# Altium project Sampler.PrjPCB (part 5 of 5)
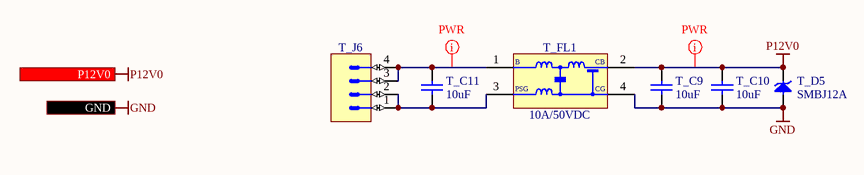
[diagram p15: PWR_input_connector.SchDoc]

## Nets that join several sheets
GND: Power_Supplies (24 pins), Power-up_delay (9 pins), Power_main_DCDC (91 pins), CPCIS_Connectors_P1_P6 (55 pins), DIOT_signal_routing (T_C22.1 T_C23.1 T_IC8.4), EEM_Connectors (34 pins), Temperature_monitoring (5 pins), Mechanical (21 pins), FP_Connectors (20 pins), ADC_8CH (30 pins), U_Input_channel0 (17 pins), U_Input_channel1 (17 pins), U_Input_channel2 (17 pins), U_Input_channel3 (17 pins), U_Input_channel4 (17 pins), U_Input_channel5 (17 pins), U_Input_channel6 (17 pins), U_Input_channel7 (17 pins), Drivers (40 pins), I2C_switch (T_C24.1 T_C25.1 T_IC9.4 T_R6.1), PWR_input_connector (T_C9.1 T_C10.1 T_D5.2 T_FL1.4)
N12V0A: Power_Supplies (LD12.1 TP9.1), Power_main_DCDC (8 pins), ADC_8CH (C105.2 IC35.4), U_Input_channel0 (8 pins), U_Input_channel1 (8 pins), U_Input_channel2 (8 pins), U_Input_channel3 (8 pins), U_Input_channel4 (8 pins), U_Input_channel5 (8 pins), U_Input_channel6 (8 pins), U_Input_channel7 (8 pins)
N13V0: Power_Supplies (LD13.1 TP20.1), Power_main_DCDC (8 pins), FP_Connectors (R42.2)
P2V5A: Power_Supplies (R91.1 TP10.1), Power_main_DCDC (7 pins), ADC_8CH (7 pins), Drivers (C16.2 IC7.1)
P3V3: Power_Supplies (R87.2 TP17.1), Power_main_DCDC (10 pins), FP_Connectors (16 pins), Drivers (41 pins), I2C_switch (T_C25.2 T_IC9.1 T_R67.2 T_R68.2)
P3V3_MP: Power_Supplies (5 pins), Power-up_delay (6 pins), DIOT_signal_routing (T_C22.2 T_C23.2 T_IC8.1 T_IC8.8), EEM_Connectors (5 pins), Temperature_monitoring (T_C8.2 T_IC6.8), I2C_switch (T_C24.2 T_IC9.8)
P3V3_MP2: Power_Supplies (R90.2 TP19.1), EEM_Connectors (5 pins)
P3V3A: Power_Supplies (R88.2 TP11.1), Power_main_DCDC (8 pins)
P5V0A: Power_Supplies (R85.2 TP13.1), Power_main_DCDC (5 pins), ADC_8CH (10 pins)
P6V0A: Power_Supplies (R84.2 TP12.1), Power_main_DCDC (8 pins)
P12V0: Power_Supplies (6 pins), Power-up_delay (T_R29.2), Power_main_DCDC (C29.2 C57.2 IC27.8 L4.1), CPCIS_Connectors_P1_P6 (7 pins), EEM_Connectors (T_J1.28 T_J1.29 T_J2.28 T_J2.29), FP_Connectors (R86.2), PWR_input_connector (T_C9.2 T_C10.2 T_D5.1 T_FL1.2)
P12V0A: Power_Supplies (R48.2 TP7.1), Power_main_DCDC (6 pins), ADC_8CH (C104.2 IC35.8), U_Input_channel0 (7 pins), U_Input_channel1 (7 pins), U_Input_channel2 (7 pins), U_Input_channel3 (7 pins), U_Input_channel4 (7 pins), U_Input_channel5 (7 pins), U_Input_channel6 (7 pins), U_Input_channel7 (7 pins)
P13V0: Power_Supplies (R46.2 TP1.1), Power_main_DCDC (9 pins), FP_Connectors (R41.2)
REF_P1V7066: ADC_8CH (IC35.1 R83.2 RN3.3), U_Input_channel0 (R7H.1 RN2H.5 RN2H.8), U_Input_channel1 (R7A.1 RN2A.5 RN2A.8), U_Input_channel2 (R7B.1 RN2B.5 RN2B.8), U_Input_channel3 (R7C.1 RN2C.5 RN2C.8), U_Input_channel4 (R7D.1 RN2D.5 RN2D.8), U_Input_channel5 (R7E.1 RN2E.5 RN2E.8), U_Input_channel6 (R7F.1 RN2F.5 RN2F.8), U_Input_channel7 (R7G.1 RN2G.5 RN2G.8)
REF_P2V048: ADC_8CH (IC35.7 RN3.2 RN4.6), U_Input_channel0 (R13H.1), U_Input_channel1 (R13A.1), U_Input_channel2 (R13B.1), U_Input_channel3 (R13C.1), U_Input_channel4 (R13D.1), U_Input_channel5 (R13E.1), U_Input_channel6 (R13F.1), U_Input_channel7 (R13G.1)
REF_P4V096: Power_Supplies (TP15.1), Power_main_DCDC (5 pins), ADC_8CH (R81.1 RN3.4)
REF_VCC: Power_Supplies (R49.2 TP8.1), Power_main_DCDC (8 pins)
A00: U_Input_channel0 (IC2H.4), Drivers (IC19.15)
A01: U_Input_channel1 (IC2A.4), Drivers (IC19.2)
A02: U_Input_channel2 (IC2B.4), Drivers (IC19.4)
A03: U_Input_channel3 (IC2C.4), Drivers (IC19.6)
A04: U_Input_channel4 (IC2D.4), Drivers (IC20.15)
A05: U_Input_channel5 (IC2E.4), Drivers (IC20.2)
A06: U_Input_channel6 (IC2F.4), Drivers (IC20.4)
A07: U_Input_channel7 (IC2G.4), Drivers (IC20.6)
A10: U_Input_channel0 (IC2H.5), Drivers (IC19.1)
A11: U_Input_channel1 (IC2A.5), Drivers (IC19.3)
A12: U_Input_channel2 (IC2B.5), Drivers (IC19.5)
A13: U_Input_channel3 (IC2C.5), Drivers (IC19.7)
A14: U_Input_channel4 (IC2D.5), Drivers (IC20.1)
A15: U_Input_channel5 (IC2E.5), Drivers (IC20.3)
A16: U_Input_channel6 (IC2F.5), Drivers (IC20.5)
A17: U_Input_channel7 (IC2G.5), Drivers (IC20.7)
ADC_CLKOUT_N: ADC_8CH (IC36.34), Drivers (IC13.8 R20.2)
ADC_CLKOUT_P: ADC_8CH (IC36.33), Drivers (IC13.1 R20.1)
ADC_CNV: ADC_8CH (IC36.24), Drivers (IC7.5)
ADC_IN_N0: ADC_8CH (IC36.47), U_Input_channel0 (C4H.2 C6H.2 R6H.2)
ADC_IN_N1: ADC_8CH (IC36.50), U_Input_channel1 (C4A.2 C6A.2 R6A.2)
ADC_IN_N2: ADC_8CH (IC36.1), U_Input_channel2 (C4B.2 C6B.2 R6B.2)
ADC_IN_N3: ADC_8CH (IC36.4), U_Input_channel3 (C4C.2 C6C.2 R6C.2)
ADC_IN_N4: ADC_8CH (IC36.10), U_Input_channel4 (C4D.2 C6D.2 R6D.2)
ADC_IN_N5: ADC_8CH (IC36.13), U_Input_channel5 (C4E.2 C6E.2 R6E.2)
ADC_IN_N6: ADC_8CH (IC36.16), U_Input_channel6 (C4F.2 C6F.2 R6F.2)
ADC_IN_N7: ADC_8CH (IC36.19), U_Input_channel7 (C4G.2 C6G.2 R6G.2)
ADC_IN_P0: ADC_8CH (IC36.48), U_Input_channel0 (C6H.1 C7H.1 R12H.2)
ADC_IN_P1: ADC_8CH (IC36.51), U_Input_channel1 (C6A.1 C7A.1 R12A.2)
ADC_IN_P2: ADC_8CH (IC36.2), U_Input_channel2 (C6B.1 C7B.1 R12B.2)
ADC_IN_P3: ADC_8CH (IC36.5), U_Input_channel3 (C6C.1 C7C.1 R12C.2)
ADC_IN_P4: ADC_8CH (IC36.11), U_Input_channel4 (C6D.1 C7D.1 R12D.2)
ADC_IN_P5: ADC_8CH (IC36.14), U_Input_channel5 (C6E.1 C7E.1 R12E.2)
ADC_IN_P6: ADC_8CH (IC36.17), U_Input_channel6 (C6F.1 C7F.1 R12F.2)
ADC_IN_P7: ADC_8CH (IC36.20), U_Input_channel7 (C6G.1 C7G.1 R12G.2)
ADC_SCK_N: ADC_8CH (IC36.42 R79.1), Drivers (IC4.5)
ADC_SCK_P: ADC_8CH (IC36.41 R79.2), Drivers (IC4.6)
ADC_SDOA_N: ADC_8CH (IC36.28), Drivers (IC5.1 IC14.1 R21.1)
ADC_SDOA_P: ADC_8CH (IC36.27), Drivers (IC5.8 IC14.8 R21.2)
ADC_SDOB_N: ADC_8CH (IC36.30), Drivers (IC15.8 R22.2)
ADC_SDOB_P: ADC_8CH (IC36.29), Drivers (IC15.1 R22.1)
ADC_SDOC_N: ADC_8CH (IC36.36), Drivers (IC16.8 R23.2)
ADC_SDOC_P: ADC_8CH (IC36.35), Drivers (IC16.1 R23.1)
ADC_SDOD_N: ADC_8CH (IC36.40), Drivers (IC17.8 R24.2)
ADC_SDOD_P: ADC_8CH (IC36.39), Drivers (IC17.1 R24.1)
BP_I2C.SCL: CPCIS_Connectors_P1_P6 (T_D2.3 T_J4.B2), DIOT_signal_routing (T_IC8.6)
BP_I2C.SDA: CPCIS_Connectors_P1_P6 (T_D2.1 T_J4.C2), DIOT_signal_routing (T_IC8.7)
BP_IO.LVDS_N0: CPCIS_Connectors_P1_P6 (T_J4.E3), DIOT_signal_routing (T_R51.1)
BP_IO.LVDS_N1: CPCIS_Connectors_P1_P6 (T_J4.B3), DIOT_signal_routing (T_R52.1)
BP_IO.LVDS_N2: CPCIS_Connectors_P1_P6 (T_J4.C4), DIOT_signal_routing (T_R53.1)
BP_IO.LVDS_N3: CPCIS_Connectors_P1_P6 (T_J4.L4), DIOT_signal_routing (T_R54.1)
BP_IO.LVDS_N4: CPCIS_Connectors_P1_P6 (T_J4.I4), DIOT_signal_routing (T_R55.1)
BP_IO.LVDS_N5: CPCIS_Connectors_P1_P6 (T_J4.K5), DIOT_signal_routing (T_R56.1)
BP_IO.LVDS_N6: CPCIS_Connectors_P1_P6 (T_J4.H5), DIOT_signal_routing (T_R57.1)
BP_IO.LVDS_N7: CPCIS_Connectors_P1_P6 (T_J4.F6), DIOT_signal_routing (T_R58.1)
BP_IO.LVDS_N8: CPCIS_Connectors_P1_P6 (T_J4.C6), DIOT_signal_routing (T_R59.1)
BP_IO.LVDS_N9: CPCIS_Connectors_P1_P6 (T_J4.L6), DIOT_signal_routing (T_R60.1)
BP_IO.LVDS_N10: CPCIS_Connectors_P1_P6 (T_J4.I6), DIOT_signal_routing (T_R61.1)
BP_IO.LVDS_N11: CPCIS_Connectors_P1_P6 (T_J5.E1), DIOT_signal_routing (T_R62.1)
BP_IO.LVDS_N12: CPCIS_Connectors_P1_P6 (T_J5.B1), DIOT_signal_routing (T_R63.1)
BP_IO.LVDS_P0: CPCIS_Connectors_P1_P6 (T_J4.D3), DIOT_signal_routing (T_R35.1)
BP_IO.LVDS_P1: CPCIS_Connectors_P1_P6 (T_J4.A3), DIOT_signal_routing (T_R36.1)
BP_IO.LVDS_P2: CPCIS_Connectors_P1_P6 (T_J4.B4), DIOT_signal_routing (T_R37.1)
BP_IO.LVDS_P3: CPCIS_Connectors_P1_P6 (T_J4.K4), DIOT_signal_routing (T_R38.1)
BP_IO.LVDS_P4: CPCIS_Connectors_P1_P6 (T_J4.H4), DIOT_signal_routing (T_R39.1)
BP_IO.LVDS_P5: CPCIS_Connectors_P1_P6 (T_J4.J5), DIOT_signal_routing (T_R40.1)
BP_IO.LVDS_P6: CPCIS_Connectors_P1_P6 (T_J4.G5), DIOT_signal_routing (T_R41.1)
BP_IO.LVDS_P7: CPCIS_Connectors_P1_P6 (T_J4.E6), DIOT_signal_routing (T_R42.1)
BP_IO.LVDS_P8: CPCIS_Connectors_P1_P6 (T_J4.B6), DIOT_signal_routing (T_R43.1)
BP_IO.LVDS_P9: CPCIS_Connectors_P1_P6 (T_J4.K6), DIOT_signal_routing (T_R44.1)
BP_IO.LVDS_P10: CPCIS_Connectors_P1_P6 (T_J4.H6), DIOT_signal_routing (T_R45.1)
BP_IO.LVDS_P11: CPCIS_Connectors_P1_P6 (T_J5.D1), DIOT_signal_routing (T_R46.1)
BP_IO.LVDS_P12: CPCIS_Connectors_P1_P6 (T_J5.A1), DIOT_signal_routing (T_R47.1)
EEM0_I2C.SCL: DIOT_signal_routing (T_IC8.3), EEM_Connectors (T_D1.3 T_IC2.1 T_IC3.6 T_J1.27), Temperature_monitoring (T_IC6.2), I2C_switch (T_IC9.6)
EEM0_I2C.SDA: DIOT_signal_routing (T_IC8.2), EEM_Connectors (T_D1.1 T_IC2.3 T_IC3.5 T_J1.26), Temperature_monitoring (T_IC6.1), I2C_switch (T_IC9.7)
EEM0_INT_I2C.SCL: Drivers (IC3.14), I2C_switch (T_IC9.3 T_R68.1)
EEM0_INT_I2C.SDA: Drivers (IC3.15), I2C_switch (T_IC9.2 T_R67.1)
EEM_IO.LVDS_N0: DIOT_signal_routing (T_R51.2), EEM_Connectors (T_J1.3), Drivers (IC4.1 R14.1)
EEM_IO.LVDS_N1: DIOT_signal_routing (T_R52.2), EEM_Connectors (T_J1.6), Drivers (IC5.5)
EEM_IO.LVDS_N2: DIOT_signal_routing (T_R53.2), EEM_Connectors (T_J1.9), Drivers (IC6.4 R15.1)
EEM_IO.LVDS_N3: DIOT_signal_routing (T_R54.2), EEM_Connectors (T_J1.12), Drivers (IC7.4 R16.1)
EEM_IO.LVDS_N4: DIOT_signal_routing (T_R55.2), EEM_Connectors (T_J1.15), Drivers (IC8.4 R17.1)
EEM_IO.LVDS_N5: DIOT_signal_routing (T_R56.2), EEM_Connectors (T_J1.18), Drivers (IC9.4 R18.1)
EEM_IO.LVDS_N6: DIOT_signal_routing (T_R57.2), EEM_Connectors (T_J1.21), Drivers (IC10.3)
EEM_IO.LVDS_N7: DIOT_signal_routing (T_R58.2), EEM_Connectors (T_J1.24), Drivers (IC11.4 R19.1)
EEM_IO.LVDS_N8: DIOT_signal_routing (T_R59.2), EEM_Connectors (T_J2.3), Drivers (IC13.5)
EEM_IO.LVDS_N9: DIOT_signal_routing (T_R60.2), EEM_Connectors (T_J2.6), Drivers (IC14.5)
EEM_IO.LVDS_N10: DIOT_signal_routing (T_R61.2), EEM_Connectors (T_J2.9), Drivers (IC15.5)
EEM_IO.LVDS_N11: DIOT_signal_routing (T_R62.2), EEM_Connectors (T_J2.12), Drivers (IC16.5)
EEM_IO.LVDS_N12: DIOT_signal_routing (T_R63.2), EEM_Connectors (T_J2.15), Drivers (IC17.5)
EEM_IO.LVDS_P0: DIOT_signal_routing (T_R35.2), EEM_Connectors (T_J1.2), Drivers (IC4.8 R14.2)
EEM_IO.LVDS_P1: DIOT_signal_routing (T_R36.2), EEM_Connectors (T_J1.5), Drivers (IC5.6)
EEM_IO.LVDS_P2: DIOT_signal_routing (T_R37.2), EEM_Connectors (T_J1.8), Drivers (IC6.3 R15.2)
EEM_IO.LVDS_P3: DIOT_signal_routing (T_R38.2), EEM_Connectors (T_J1.11), Drivers (IC7.3 R16.2)
EEM_IO.LVDS_P4: DIOT_signal_routing (T_R39.2), EEM_Connectors (T_J1.14), Drivers (IC8.3 R17.2)
EEM_IO.LVDS_P5: DIOT_signal_routing (T_R40.2), EEM_Connectors (T_J1.17), Drivers (IC9.3 R18.2)
EEM_IO.LVDS_P6: DIOT_signal_routing (T_R41.2), EEM_Connectors (T_J1.20), Drivers (IC10.4)
EEM_IO.LVDS_P7: DIOT_signal_routing (T_R42.2), EEM_Connectors (T_J1.23), Drivers (IC11.3 R19.2)
EEM_IO.LVDS_P8: DIOT_signal_routing (T_R43.2), EEM_Connectors (T_J2.2), Drivers (IC13.6)
EEM_IO.LVDS_P9: DIOT_signal_routing (T_R44.2), EEM_Connectors (T_J2.5), Drivers (IC14.6)
EEM_IO.LVDS_P10: DIOT_signal_routing (T_R45.2), EEM_Connectors (T_J2.8), Drivers (IC15.6)
EEM_IO.LVDS_P11: DIOT_signal_routing (T_R46.2), EEM_Connectors (T_J2.11), Drivers (IC16.6)
EEM_IO.LVDS_P12: DIOT_signal_routing (T_R47.2), EEM_Connectors (T_J2.14), Drivers (IC17.6)
GA0: Power-up_delay (T_R31.1 T_T2.1), CPCIS_Connectors_P1_P6 (T_R13.1)
GA1: Power-up_delay (T_R32.1 T_T3.1), CPCIS_Connectors_P1_P6 (T_R14.1)
GA2: Power-up_delay (T_R33.1 T_T4.1), CPCIS_Connectors_P1_P6 (T_R16.1)
GA3: Power-up_delay (T_R34.1 T_T5.1), CPCIS_Connectors_P1_P6 (T_R18.1)
IN_N0: FP_Connectors (P1.2 P5.23), U_Input_channel0 (L1H.2 R8H.1 SW1H.1)
IN_N1: FP_Connectors (J4.2 P5.20), U_Input_channel1 (L1A.2 R8A.1 SW1A.1)
IN_N2: FP_Connectors (P1.6 P5.17), U_Input_channel2 (L1B.2 R8B.1 SW1B.1)
IN_N3: FP_Connectors (J5.2 P5.14), U_Input_channel3 (L1C.2 R8C.1 SW1C.1)
IN_N4: FP_Connectors (P2.2 P5.11), U_Input_channel4 (L1D.2 R8D.1 SW1D.1)
IN_N5: FP_Connectors (J6.2 P5.8), U_Input_channel5 (L1E.2 R8E.1 SW1E.1)
IN_N6: FP_Connectors (P2.6 P5.5), U_Input_channel6 (L1F.2 R8F.1 SW1F.1)
IN_N7: FP_Connectors (J7.2 P5.2), U_Input_channel7 (L1G.2 R8G.1 SW1G.1)
IN_P0: FP_Connectors (P1.1 P5.22), U_Input_channel0 (L1H.1 R1H.1 R5H.2)
IN_P1: FP_Connectors (J4.1 P5.19), U_Input_channel1 (L1A.1 R1A.1 R5A.2)
IN_P2: FP_Connectors (P1.5 P5.16), U_Input_channel2 (L1B.1 R1B.1 R5B.2)
IN_P3: FP_Connectors (J5.1 P5.13), U_Input_channel3 (L1C.1 R1C.1 R5C.2)
IN_P4: FP_Connectors (P2.1 P5.10), U_Input_channel4 (L1D.1 R1D.1 R5D.2)
IN_P5: FP_Connectors (J6.1 P5.7), U_Input_channel5 (L1E.1 R1E.1 R5E.2)
IN_P6: FP_Connectors (P2.5 P5.4), U_Input_channel6 (L1F.1 R1F.1 R5F.2)
IN_P7: FP_Connectors (J7.1 P5.1), U_Input_channel7 (L1G.1 R1G.1 R5G.2)
PGOOD: Power_Supplies (T_T1.1), Power_main_DCDC (R157.2), I2C_switch (T_R5.1)
PSU_EN: Power_Supplies (LD14.3 T_R8.1), Power-up_delay (T_IC7.1), Power_main_DCDC (IC31.3), Temperature_monitoring (T_IC6.3)
RSTn: Power-up_delay (T_D6.1), CPCIS_Connectors_P1_P6 (T_R15.1)
SDR_MODE: ADC_8CH (T9.1), Drivers (IC6.5)
SERVMOD_3V3: CPCIS_Connectors_P1_P6 (T_R17.1 T_R19.2), DIOT_signal_routing (T_IC8.5)
SR_~{OE}: Power_main_DCDC (IC27.7 R65.1), Drivers (IC19.13 IC20.13)
TERM_IND0: FP_Connectors (R25.2 T1.1), U_Input_channel0 (SW1H.2), Drivers (IC3.4)
TERM_IND1: FP_Connectors (R27.2 T2.1), U_Input_channel1 (SW1A.2), Drivers (IC3.5)
TERM_IND2: FP_Connectors (R29.2 T3.1), U_Input_channel2 (SW1B.2), Drivers (IC3.6)
TERM_IND3: FP_Connectors (R31.2 T4.1), U_Input_channel3 (SW1C.2), Drivers (IC3.7)
TERM_IND4: FP_Connectors (R33.2 T5.1), U_Input_channel4 (SW1D.2), Drivers (IC3.9)
TERM_IND5: FP_Connectors (R36.2 T6.1), U_Input_channel5 (SW1E.2), Drivers (IC3.10)
TERM_IND6: FP_Connectors (R39.2 T7.1), U_Input_channel6 (SW1F.2), Drivers (IC3.11)
TERM_IND7: FP_Connectors (R43.2 T8.1), U_Input_channel7 (SW1G.2), Drivers (IC3.12)

## Assembly variants
EEM: not fitted C6A C6B C6C C6D C6E C6F C6G C6H C42 C46 C75 CLIP1 CLIP2 CLIP3 CLIP4 CLIP5 CLIP6 CLIP7 CLIP8 CLIP9 CLIP10 CLIP11 CLIP12 CLIP13 CLIP14 CLIP15 CLIP16 CLIP17 CLIP18 IC23 IC24 IC30 IC34 R1A R1B R1C R1D R1E R1F R1G R1H R8A R8B R8C R8D R8E R8F R8G R8H R41 R42 R56 R86 T_IC3 T_IC5 T_J4 T_J5 T_R2 T_R4 T_R35 T_R36 T_R37 T_R38 T_R39 T_R40 T_R41 T_R42 T_R43 T_R44 T_R45 T_R46 T_R47 T_R51 T_R52 T_R53 T_R54 T_R55 T_R56 T_R57 T_R58 T_R59 T_R60 T_R61 T_R62 T_R63; alternate parts T_R26 -> R0805_0R_JUMPER
DIOT: not fitted C6A C6B C6C C6D C6E C6F C6G C6H C42 C46 C75 CLIP1 CLIP2 CLIP3 CLIP4 CLIP5 CLIP6 CLIP7 CLIP8 CLIP9 CLIP10 CLIP11 CLIP12 CLIP13 CLIP14 CLIP15 CLIP16 CLIP17 CLIP18 IC23 IC24 IC30 IC34 R1A R1B R1C R1D R1E R1F R1G R1H R8A R8B R8C R8D R8E R8F R8G R8H R41 R42 R56 R86 T_IC3 T_IC5